# EAGLE schematic CB_1-2 (EAGLE 7.2.0)
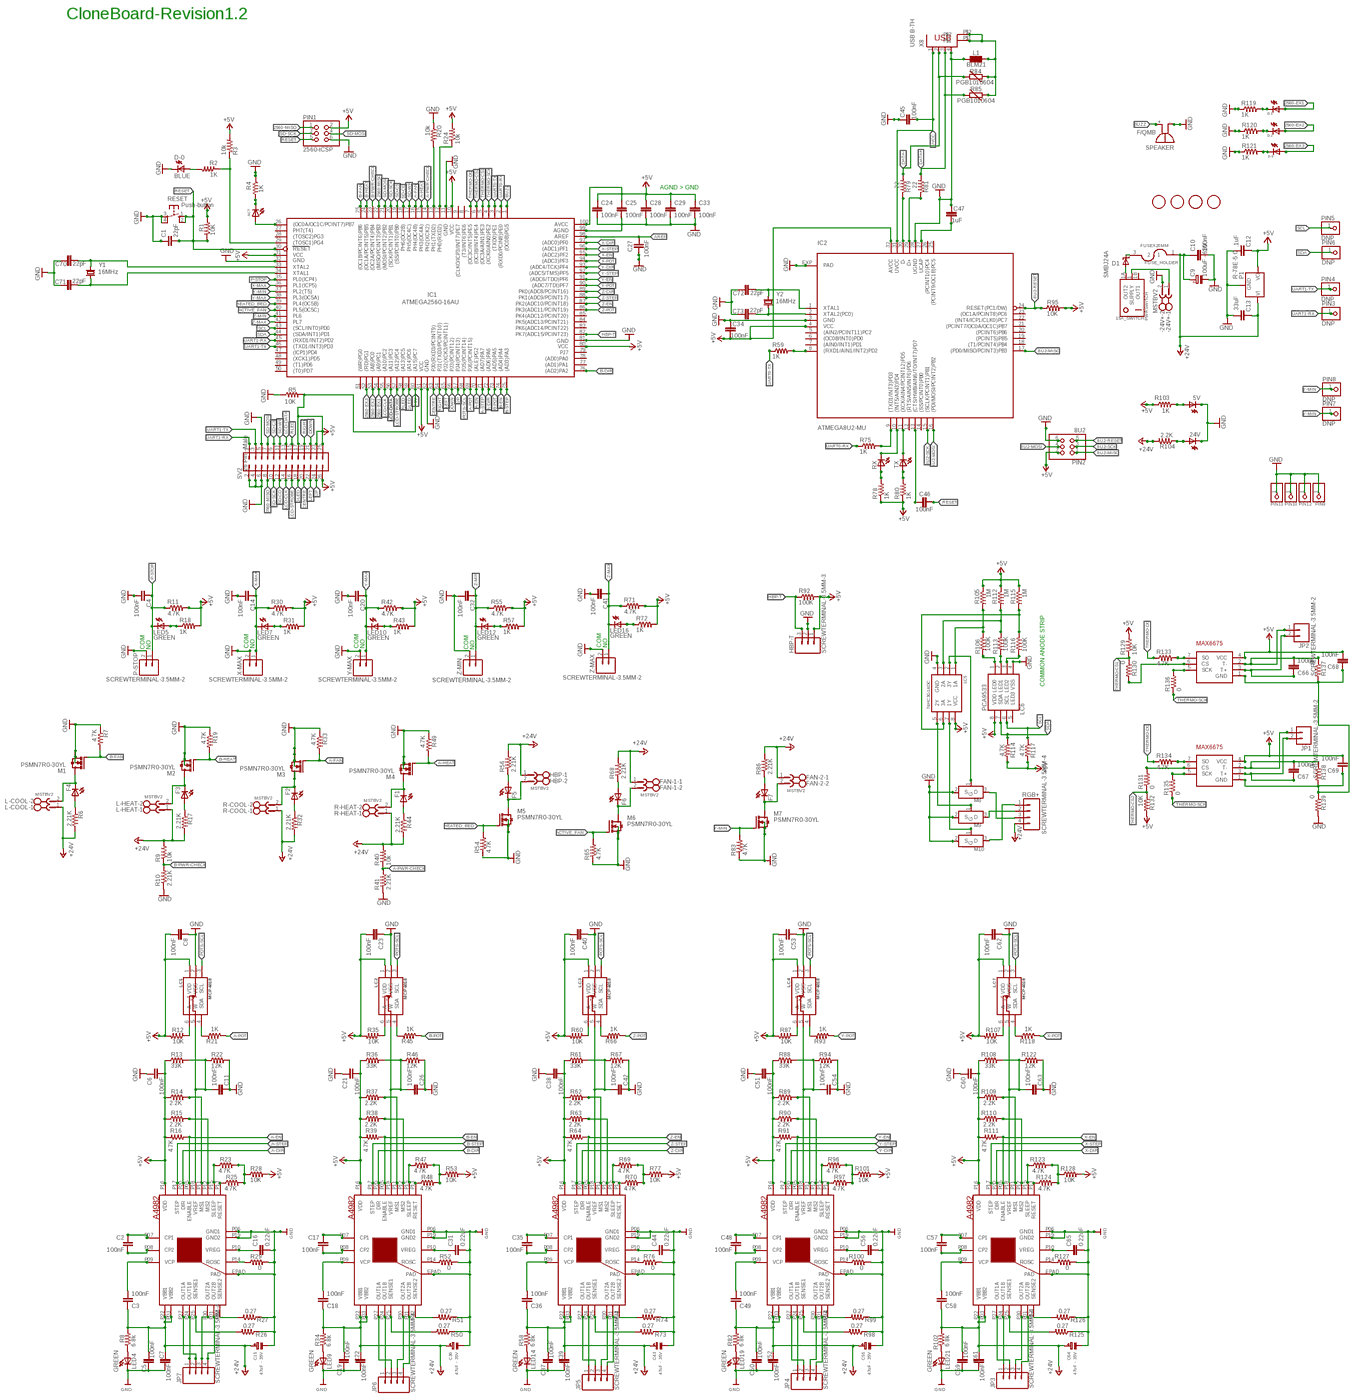
[diagram p0: schematic, sheet 1, overview]
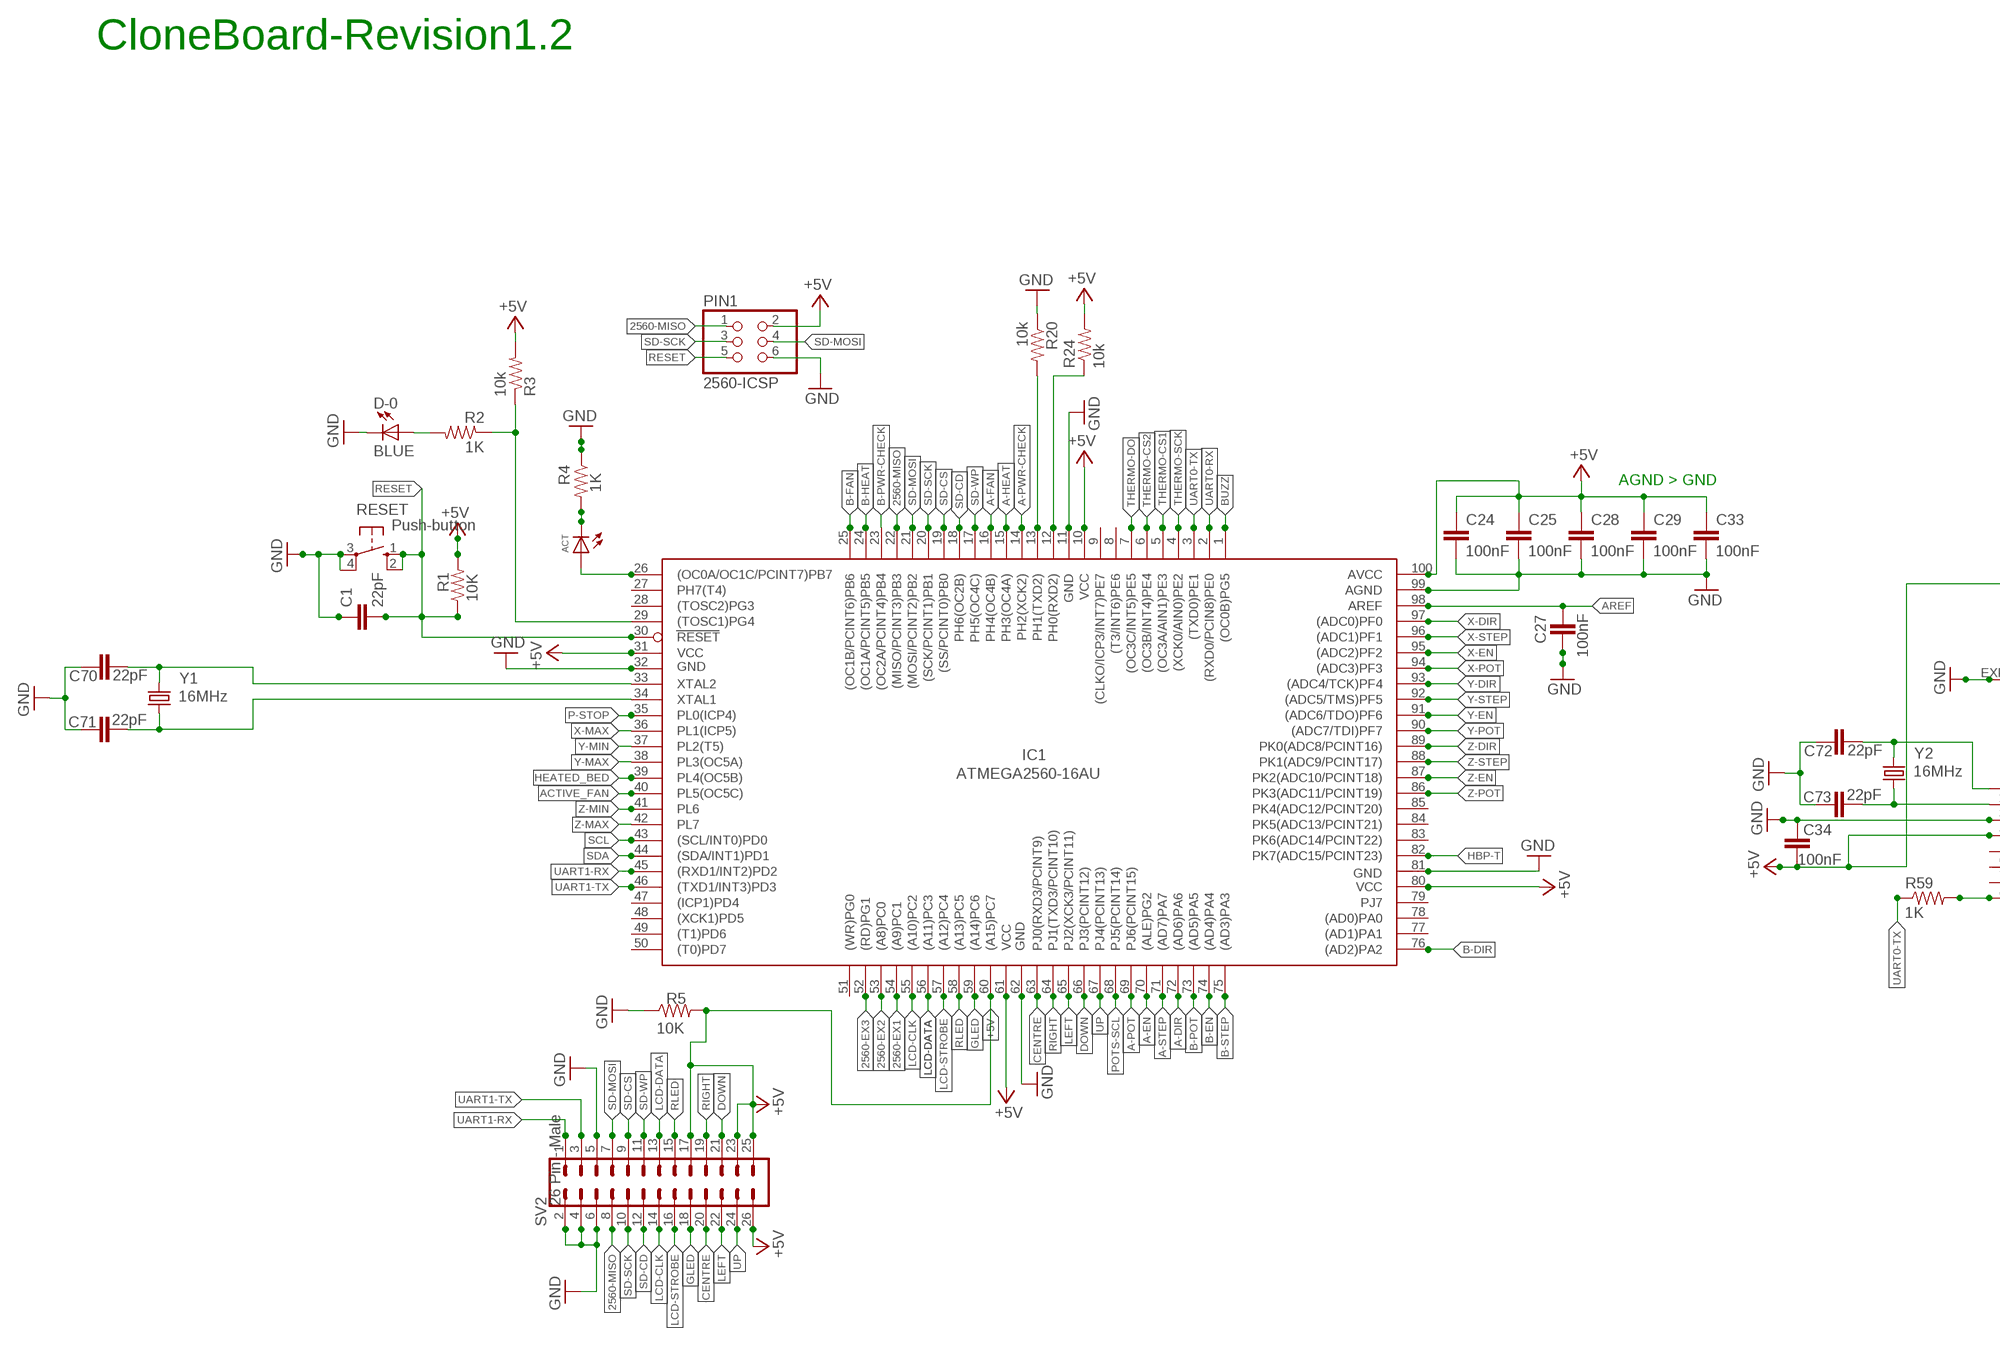
[diagram p1: schematic, sheet 1, part 1 of 4]
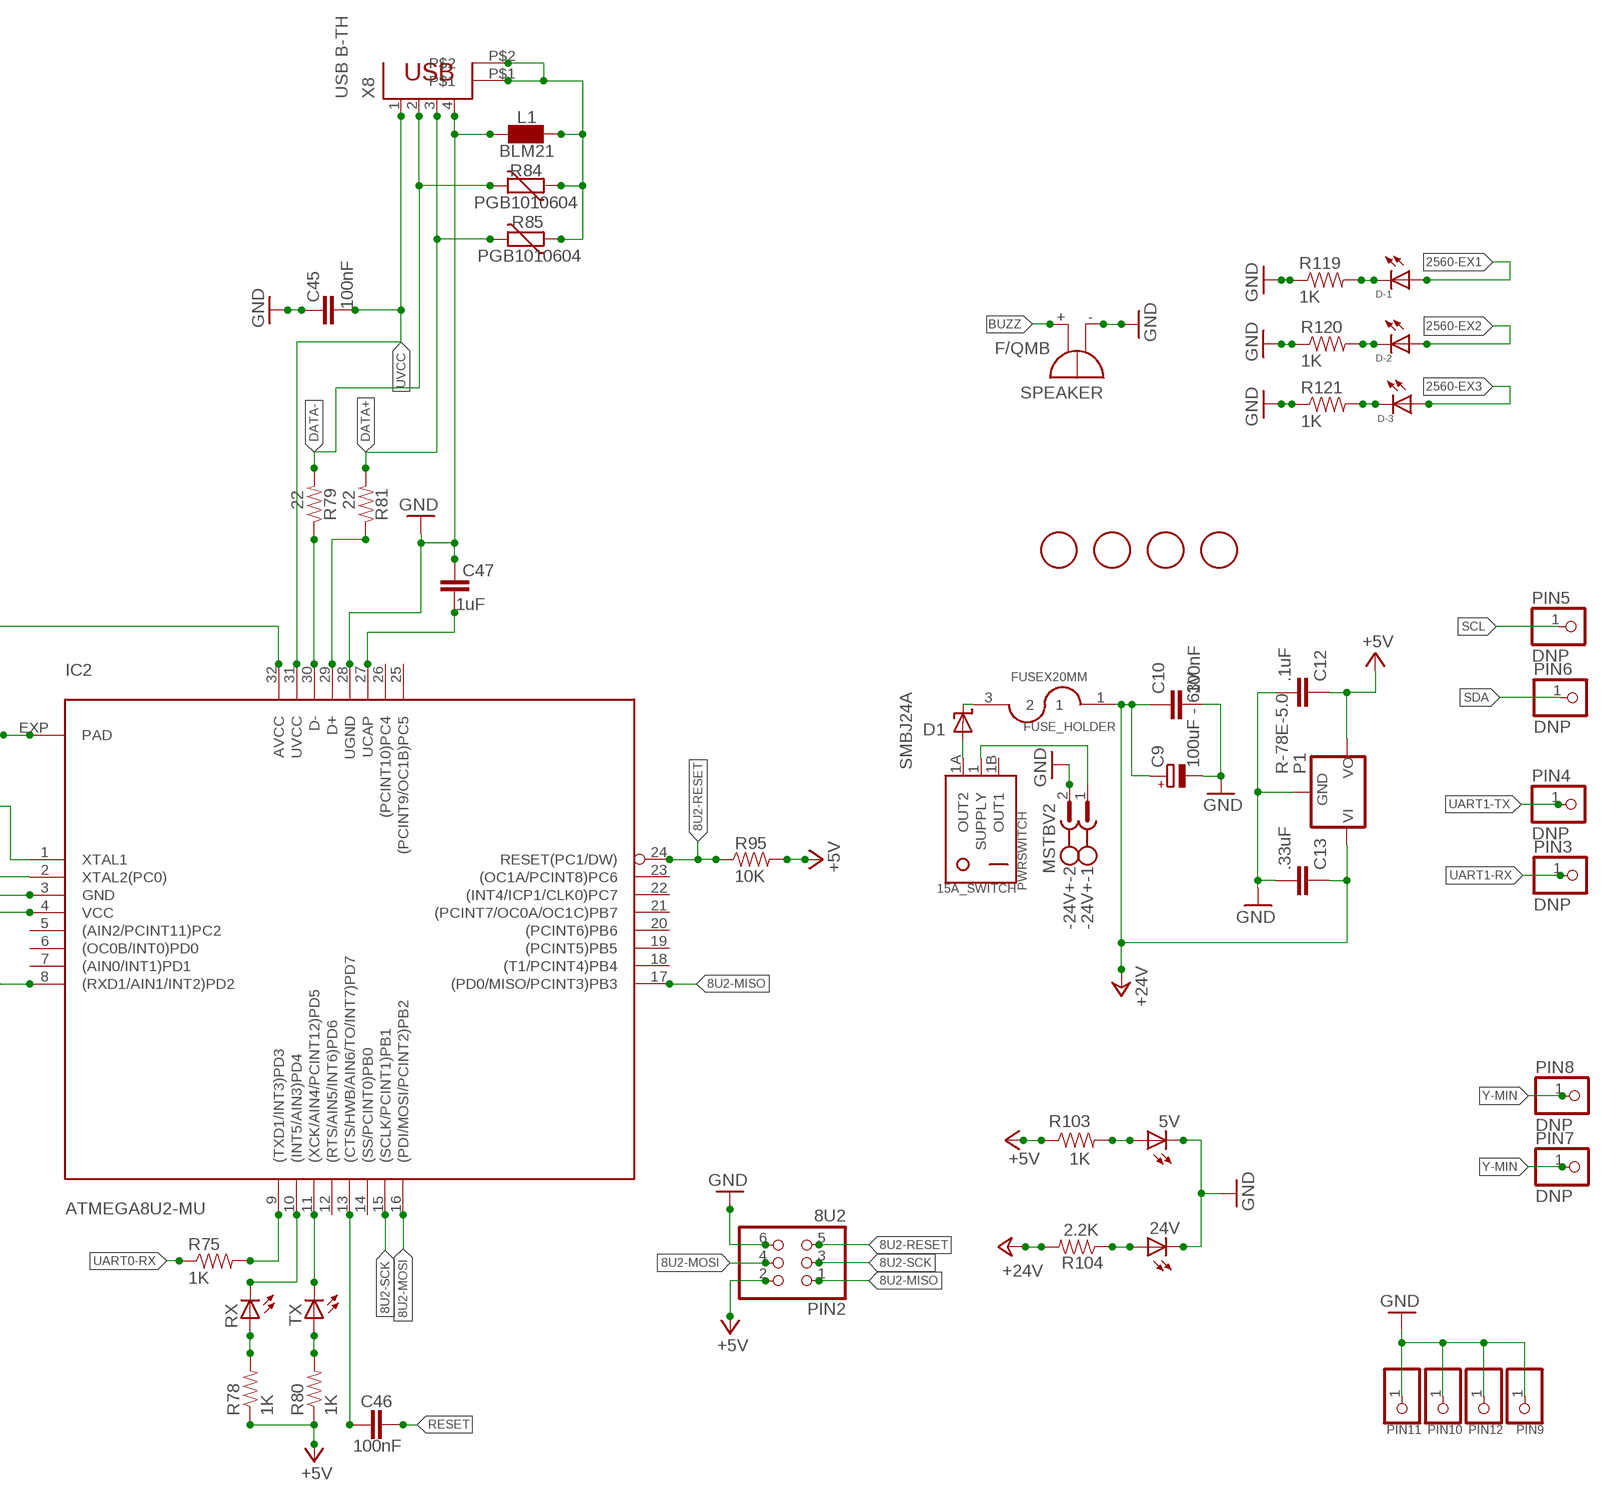
[diagram p2: schematic, sheet 1, part 2 of 4]
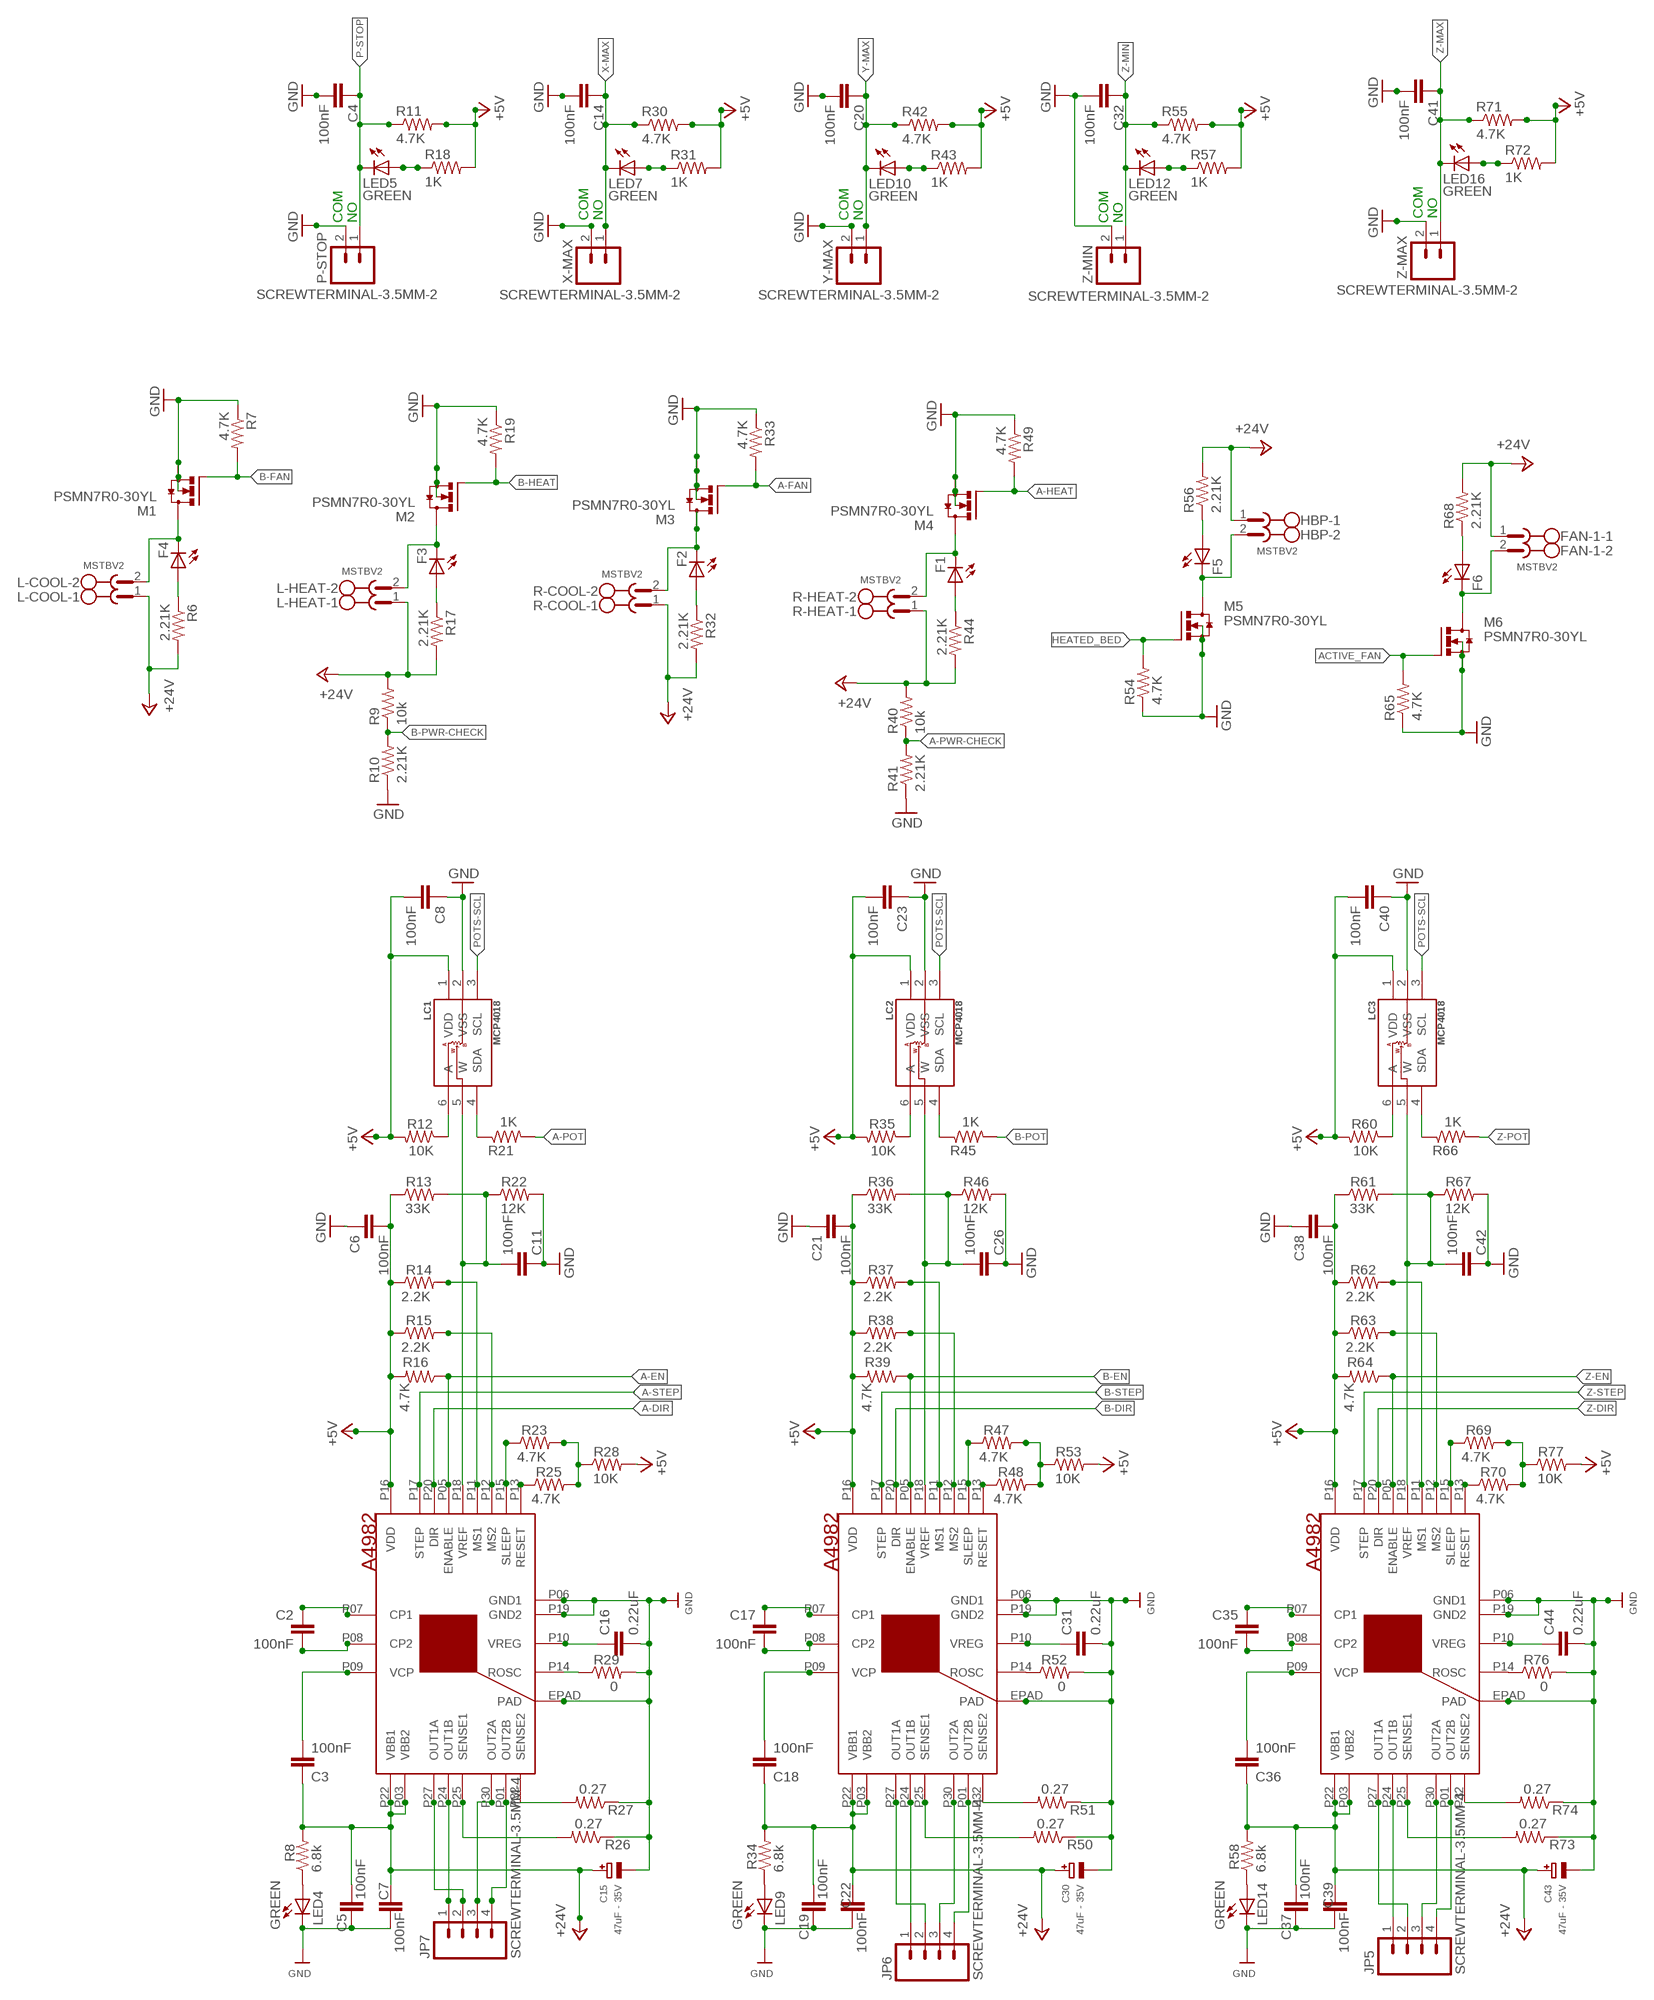
[diagram p3: schematic, sheet 1, part 3 of 4]
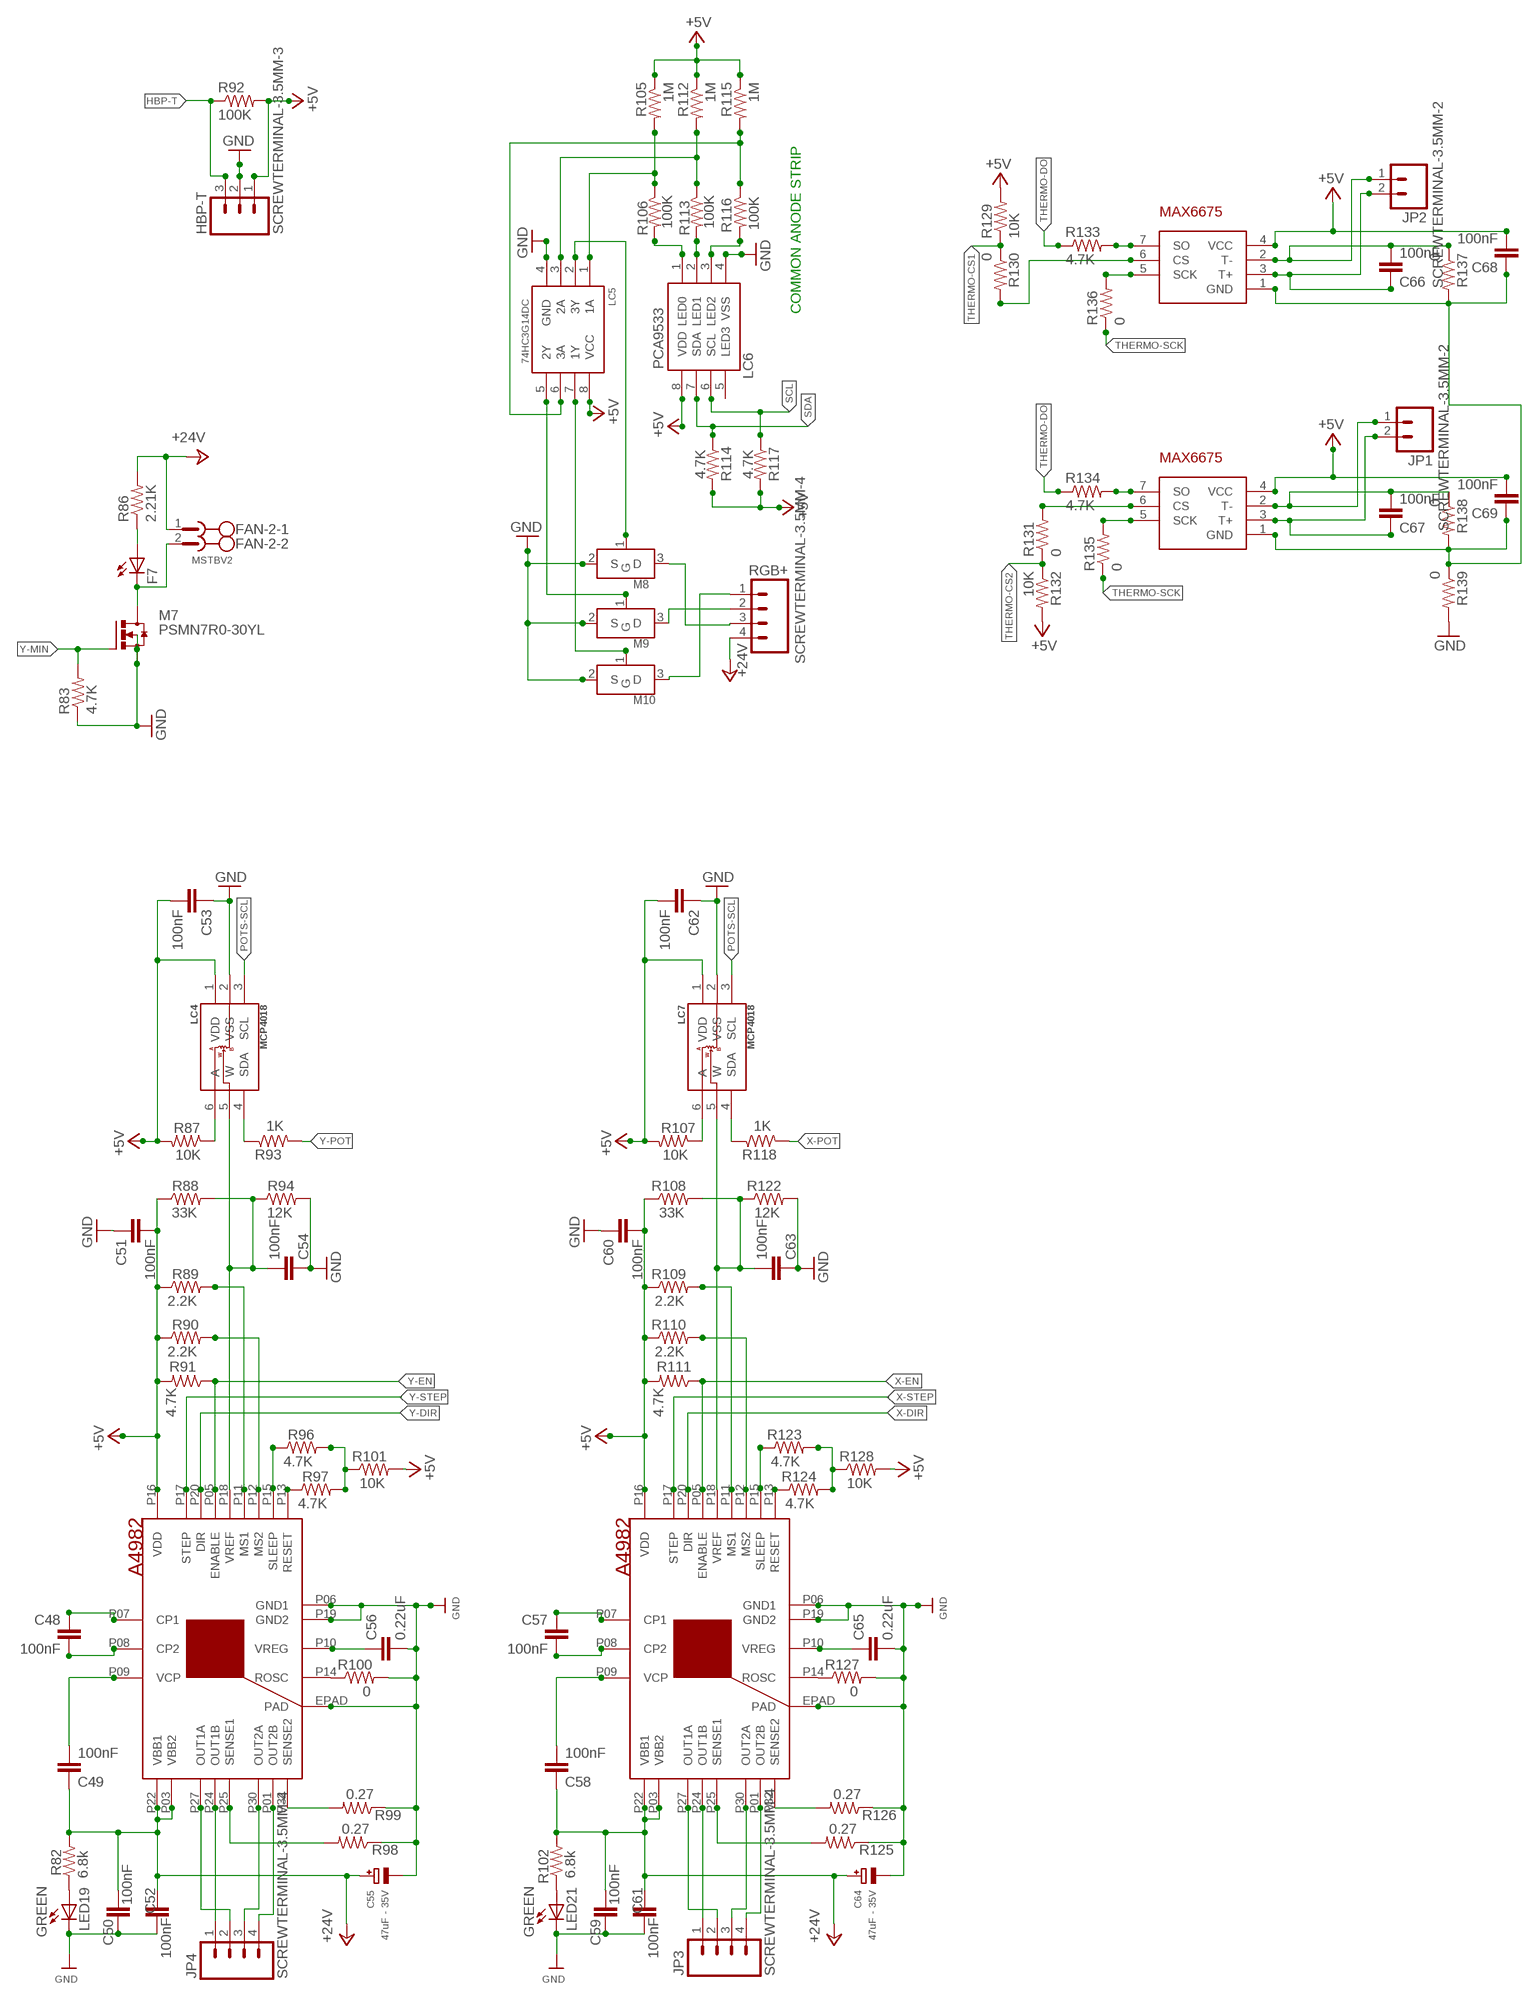
[diagram p4: schematic, sheet 1, part 4 of 4]

## Parts
5V  BLUE  LED0805  [LED-0805]
15A_SWITCH  PWRSWITCH  [D501JT2S2APQF]
24V  GREEN  LED0805  [LED-0805]
-24V+  MSTBV2  [MSTBV2]
A1  A4982ETSSOP32  [ETSSOP32]
A2  A4982ETSSOP32  [ETSSOP32]
A3  A4982ETSSOP32  [ETSSOP32]
A4  A4982ETSSOP32  [ETSSOP32]
A5  A4982ETSSOP32  [ETSSOP32]
ACT  BLUE  LED0805  [LED-0805]
C1  22pF  CAP0805  [0805]
C2  100nF  CAP0805  [0805]
C3  100nF  CAP0805  [0805]
C4  100nF  CAP0805  [0805]
C5  100nF  CAP0805  [0805]
C6  100nF  CAP0805  [0805]
C7  100nF  CAP0805  [0805]
C8  100nF  CAP0805  [0805]
C9  100uF - 63V  CPOL-EUE3.5-8  [E3,5-8]
C10  100nF  CAP0805  [0805]
C11  100nF  CAP0805  [0805]
C12  .1uF  C-EUC0603  [C0603]
C13  .33uF  C-EUC0603  [C0603]
C14  100nF  CAP0805  [0805]
C15  47uF - 35V  CAP_TANTALUMD/7343_REFLOW  [EIA7343-31/D-R]
C16  0.22uF  CAP0805  [0805]
C17  100nF  CAP0805  [0805]
C18  100nF  CAP0805  [0805]
C19  100nF  CAP0805  [0805]
C20  100nF  CAP0805  [0805]
C21  100nF  CAP0805  [0805]
C22  100nF  CAP0805  [0805]
C23  100nF  CAP0805  [0805]
C24  100nF  CAP0805  [0805]
C25  100nF  CAP0805  [0805]
C26  100nF  CAP0805  [0805]
C27  100nF  CAP0805  [0805]
C28  100nF  CAP0805  [0805]
C29  100nF  CAP0805  [0805]
C30  47uF - 35V  CAP_TANTALUMD/7343_REFLOW  [EIA7343-31/D-R]
C31  0.22uF  CAP0805  [0805]
C32  100nF  CAP0805  [0805]
C33  100nF  CAP0805  [0805]
C34  100nF  CAP0805  [0805]
C35  100nF  CAP0805  [0805]
C36  100nF  CAP0805  [0805]
C37  100nF  CAP0805  [0805]
C38  100nF  CAP0805  [0805]
C39  100nF  CAP0805  [0805]
C40  100nF  CAP0805  [0805]
C41  100nF  CAP0805  [0805]
C42  100nF  CAP0805  [0805]
C43  47uF - 35V  CAP_TANTALUMD/7343_REFLOW  [EIA7343-31/D-R]
C44  0.22uF  CAP0805  [0805]
C45  100nF  CAP0805  [0805]
C46  100nF  CAP0805  [0805]
C47  1uF  CAP0805  [0805]
C48  100nF  CAP0805  [0805]
C49  100nF  CAP0805  [0805]
C50  100nF  CAP0805  [0805]
C51  100nF  CAP0805  [0805]
C52  100nF  CAP0805  [0805]
C53  100nF  CAP0805  [0805]
C54  100nF  CAP0805  [0805]
C55  47uF - 35V  CAP_TANTALUMD/7343_REFLOW  [EIA7343-31/D-R]
C56  0.22uF  CAP0805  [0805]
C57  100nF  CAP0805  [0805]
C58  100nF  CAP0805  [0805]
C59  100nF  CAP0805  [0805]
C60  100nF  CAP0805  [0805]
C61  100nF  CAP0805  [0805]
C62  100nF  CAP0805  [0805]
C63  100nF  CAP0805  [0805]
C64  47uF - 35V  CAP_TANTALUMD/7343_REFLOW  [EIA7343-31/D-R]
C65  0.22uF  CAP0805  [0805]
C66  100nF  CAP0805  [0805]
C67  100nF  CAP0805  [0805]
C68  100nF  CAP0805  [0805]
C69  100nF  CAP0805  [0805]
C70  22pF  CAP0805  [0805]
C71  22pF  CAP0805  [0805]
C72  22pF  CAP0805  [0805]
C73  22pF  CAP0805  [0805]
D1  SMBJ24A  SUPPRESSOR-SMBJ  [SMBJ]
D-0  BLUE  LED0805  [LED-0805]
D-1  YELLOW  LED0805  [LED-0805]
D-2  ORANGE  LED0805  [LED-0805]
D-3  RED  LED0805  [LED-0805]
F1  RED  LED0805  [LED-0805]
F2  Yellow  LED0805  [LED-0805]
F3  RED  LED0805  [LED-0805]
F4  Yellow  LED0805  [LED-0805]
F5  RED  LED0805  [LED-0805]
F6  Yellow  LED0805  [LED-0805]
F7  Yellow  LED0805  [LED-0805]
FAN-1  MSTBV2  [MSTBV2]
FAN-2  MSTBV2  [MSTBV2]
FID1  FIDUCIALMOUNT  [FIDUCIA-MOUNT]
FID2  FIDUCIALMOUNT  [FIDUCIA-MOUNT]
FID3  FIDUCIALMOUNT  [FIDUCIA-MOUNT]
FID4  FIDUCIALMOUNT  [FIDUCIA-MOUNT]
FUSE_HOLDER  FUSEX20MM  [FUSE_5MM]
HBP  MSTBV2  [MSTBV2]
HBP-T  SCREWTERMINAL-3.5MM-3  M03SCREW  [SCREWTERMINAL-3.5MM-3]
IC1  ATMEGA2560-16AU  [TQFP100]
IC2  ATMEGA8U2-MU  ATMEGA8U2  [ATMEL_QFN32]
JP1  SCREWTERMINAL-3.5MM-2  M023.5MM  [SCREWTERMINAL-3.5MM-2]
JP2  SCREWTERMINAL-3.5MM-2  M023.5MM  [SCREWTERMINAL-3.5MM-2]
JP3  SCREWTERMINAL-3.5MM-4  M04SCREW_LOCK  [SCREWTERMINAL-3.5MM-4_LOCK]
JP4  SCREWTERMINAL-3.5MM-4  M04SCREW_LOCK  [SCREWTERMINAL-3.5MM-4_LOCK]
JP5  SCREWTERMINAL-3.5MM-4  M04SCREW_LOCK  [SCREWTERMINAL-3.5MM-4_LOCK]
JP6  SCREWTERMINAL-3.5MM-4  M04SCREW_LOCK  [SCREWTERMINAL-3.5MM-4_LOCK]
JP7  SCREWTERMINAL-3.5MM-4  M04SCREW_LOCK  [SCREWTERMINAL-3.5MM-4_LOCK]
L1  BLM21  WE-CBF_0805  [0805]
L-COOL  MSTBV2  [MSTBV2]
L-HEAT  MSTBV2  [MSTBV2]
LC1  MCP4018  [SC70-6L]
LC2  MCP4018  [SC70-6L]
LC3  MCP4018  [SC70-6L]
LC4  MCP4018  [SC70-6L]
LC5  74HC3G14DC  [VSSOP8]
LC6  PCA9533  [SO8]
LC7  MCP4018  [SC70-6L]
LED4  GREEN  LED0805  [LED-0805]
LED5  GREEN  LED0805  [LED-0805]
LED7  GREEN  LED0805  [LED-0805]
LED9  GREEN  LED0805  [LED-0805]
LED10  GREEN  LED0805  [LED-0805]
LED12  GREEN  LED0805  [LED-0805]
LED14  GREEN  LED0805  [LED-0805]
LED16  GREEN  LED0805  [LED-0805]
LED19  GREEN  LED0805  [LED-0805]
LED21  GREEN  LED0805  [LED-0805]
M1  PSMN7R0-30YL  [SOT669]
M2  PSMN7R0-30YL  [SOT669]
M3  PSMN7R0-30YL  [SOT669]
M4  PSMN7R0-30YL  [SOT669]
M5  PSMN7R0-30YL  [SOT669]
M6  PSMN7R0-30YL  [SOT669]
M7  PSMN7R0-30YL  [SOT669]
M8  FDV301N  [SOT-23]
M9  FDV301N  [SOT-23]
M10  FDV301N  [SOT-23]
P1  R-78E-5.0  R-78  [R-78]
P-STOP  SCREWTERMINAL-3.5MM-2  M023.5MM  [SCREWTERMINAL-3.5MM-2]
PIN1  2560-ICSP  PINHD-2X3  [2X03]
PIN2  8U2  PINHD-2X3  [2X03]
PIN3  DNP  PINHD-1X1  [1X01]
PIN4  DNP  PINHD-1X1  [1X01]
PIN5  DNP  PINHD-1X1  [1X01]
PIN6  DNP  PINHD-1X1  [1X01]
PIN7  DNP  PINHD-1X1  [1X01]
PIN8  DNP  PINHD-1X1  [1X01]
PIN9  DNP  PINHD-1X1  [1X01]
PIN10  DNP  PINHD-1X1  [1X01]
PIN11  DNP  PINHD-1X1  [1X01]
PIN12  DNP  PINHD-1X1  [1X01]
R1  10K  RESISTOR  [0805]
R2  1K  RESISTOR  [0805]
R3  10k  RESISTOR  [0805]
R4  1K  RESISTOR  [0805]
R5  10K  RESISTOR  [0805]
R6  2.21K  RESISTOR  [0805]
R7  4.7K  RESISTOR  [0805]
R8  6.8k  RESISTOR  [0805]
R9  10k  RESISTOR  [0805]
R10  2.21K  RESISTOR  [0805]
R11  4.7K  RESISTOR  [0805]
R12  10K  RESISTOR  [0805]
R13  33K  RESISTOR  [0805]
R14  2.2K  RESISTOR  [0805]
R15  2.2K  RESISTOR  [0805]
R16  4.7K  RESISTOR  [0805]
R17  2.21K  RESISTOR  [0805]
R18  1K  RESISTOR  [0805]
R19  4.7K  RESISTOR  [0805]
R20  10k  RESISTOR  [0805]
R21  1K  RESISTOR  [0805]
R22  12K  RESISTOR  [0805]
R23  4.7K  RESISTOR  [0805]
R24  10k  RESISTOR  [0805]
R25  4.7K  RESISTOR  [0805]
R26  0.27  RESISTOR  [0805]
R27  0.27  RESISTOR  [0805]
R28  10K  RESISTOR  [0805]
R29  0  RESISTOR  [0805]
R30  4.7K  RESISTOR  [0805]
R31  1K  RESISTOR  [0805]
R32  2.21K  RESISTOR  [0805]
R33  4.7K  RESISTOR  [0805]
R34  6.8k  RESISTOR  [0805]
R35  10K  RESISTOR  [0805]
R36  33K  RESISTOR  [0805]
R37  2.2K  RESISTOR  [0805]
R38  2.2K  RESISTOR  [0805]
R39  4.7K  RESISTOR  [0805]
R40  10k  RESISTOR  [0805]
R41  2.21K  RESISTOR  [0805]
R42  4.7K  RESISTOR  [0805]
R43  1K  RESISTOR  [0805]
R44  2.21K  RESISTOR  [0805]
R45  1K  RESISTOR  [0805]
R46  12K  RESISTOR  [0805]
R47  4.7K  RESISTOR  [0805]
R48  4.7K  RESISTOR  [0805]
R49  4.7K  RESISTOR  [0805]
R50  0.27  RESISTOR  [0805]
R51  0.27  RESISTOR  [0805]
R52  0  RESISTOR  [0805]
R53  10K  RESISTOR  [0805]
R54  4.7K  RESISTOR  [0805]
R55  4.7K  RESISTOR  [0805]
R56  2.21K  RESISTOR  [0805]
R57  1K  RESISTOR  [0805]
R58  6.8k  RESISTOR  [0805]
R59  1K  RESISTOR  [0805]
R60  10K  RESISTOR  [0805]
R61  33K  RESISTOR  [0805]
R62  2.2K  RESISTOR  [0805]
R63  2.2K  RESISTOR  [0805]
R64  4.7K  RESISTOR  [0805]
R65  4.7K  RESISTOR  [0805]
R66  1K  RESISTOR  [0805]
R67  12K  RESISTOR  [0805]
R68  2.21K  RESISTOR  [0805]
R69  4.7K  RESISTOR  [0805]
R70  4.7K  RESISTOR  [0805]
R71  4.7K  RESISTOR  [0805]
R72  1K  RESISTOR  [0805]
R73  0.27  RESISTOR  [0805]
R74  0.27  RESISTOR  [0805]
R75  1K  RESISTOR  [0805]
R76  0  RESISTOR  [0805]
R77  10K  RESISTOR  [0805]
R78  1K  RESISTOR  [0805]
R79  22  RESISTOR  [0805]
R80  1K  RESISTOR  [0805]
R81  22  RESISTOR  [0805]
R82  6.8k  RESISTOR  [0805]
R83  4.7K  RESISTOR  [0805]
R84  PGB1010604  VARISTORCN0603  [CT/CN0603]
R85  PGB1010604  VARISTORCN0603  [CT/CN0603]
R86  2.21K  RESISTOR  [0805]
R87  10K  RESISTOR  [0805]
R88  33K  RESISTOR  [0805]
R89  2.2K  RESISTOR  [0805]
R90  2.2K  RESISTOR  [0805]
R91  4.7K  RESISTOR  [0805]
R92  100K  RESISTOR  [0805]
R93  1K  RESISTOR  [0805]
R94  12K  RESISTOR  [0805]
R95  10K  RESISTOR  [0805]
R96  4.7K  RESISTOR  [0805]
R97  4.7K  RESISTOR  [0805]
R98  0.27  RESISTOR  [0805]
R99  0.27  RESISTOR  [0805]
R100  0  RESISTOR  [0805]
R101  10K  RESISTOR  [0805]
R102  6.8k  RESISTOR  [0805]
R103  1K  RESISTOR  [0805]
R104  2.2K  RESISTOR  [0805]
R105  1M  RESISTOR  [0805]
R106  100K  RESISTOR  [0805]
R107  10K  RESISTOR  [0805]
R108  33K  RESISTOR  [0805]
R109  2.2K  RESISTOR  [0805]
R110  2.2K  RESISTOR  [0805]
R111  4.7K  RESISTOR  [0805]
R112  1M  RESISTOR  [0805]
R113  100K  RESISTOR  [0805]
R114  4.7K  RESISTOR  [0805]
R115  1M  RESISTOR  [0805]
R116  100K  RESISTOR  [0805]
R117  4.7K  RESISTOR  [0805]
R118  1K  RESISTOR  [0805]
R119  1K  RESISTOR  [0805]
R120  1K  RESISTOR  [0805]
R121  1K  RESISTOR  [0805]
R122  12K  RESISTOR  [0805]
R123  4.7K  RESISTOR  [0805]
R124  4.7K  RESISTOR  [0805]
R125  0.27  RESISTOR  [0805]
R126  0.27  RESISTOR  [0805]
R127  0  RESISTOR  [0805]
R128  10K  RESISTOR  [0805]
R129  10K  RESISTOR  [0805]
R130  0  RESISTOR  [0805]
R131  0  RESISTOR  [0805]
R132  10K  RESISTOR  [0805]
R133  4.7K  RESISTOR  [0805]
R134  4.7K  RESISTOR  [0805]
R135  0  RESISTOR  [0805]
R136  0  RESISTOR  [0805]
R137  0  RESISTOR  [0805]
R138  0  RESISTOR  [0805]
R139  0  RESISTOR  [0805]
R-COOL  MSTBV2  [MSTBV2]
R-HEAT  MSTBV2  [MSTBV2]
RESET  Push-button  10-XX  [B3F-10XX]
RGB+  SCREWTERMINAL-3.5MM-4  M04SCREW  [SCREWTERMINAL-3.5MM-4]
RX  YELLOW  LED0805  [LED-0805]
SPEAKER  F/QMB  [F/QMB]
SV2  26 Pin - Male  ML26  [ML26]
T1  MAX6675  [SO08]
T2  MAX6675  [SO08]
TX  YELLOW  LED0805  [LED-0805]
X8  USB B-TH  PN61729  [PN61729]
X-MAX  SCREWTERMINAL-3.5MM-2  M023.5MM  [SCREWTERMINAL-3.5MM-2]
Y1  16MHz  CRYTALHC49S  [HC49/S]
Y2  16MHz  CRYTALHC49S  [HC49/S]
Y-MAX  SCREWTERMINAL-3.5MM-2  M023.5MM  [SCREWTERMINAL-3.5MM-2]
Z-MAX  SCREWTERMINAL-3.5MM-2  M023.5MM  [SCREWTERMINAL-3.5MM-2]
Z-MIN  SCREWTERMINAL-3.5MM-2  M023.5MM  [SCREWTERMINAL-3.5MM-2]

## Nets
8U2-MISO: IC2.17((PD0/MISO/PCINT3)PB3) PIN2.1
8U2-MOSI: IC2.16((PDI/MOSI/PCINT2)PB2) PIN2.4
8U2-RESET: IC2.24(RESET(PC1/DW)) PIN2.5 R95.1
8U2-SCK: IC2.15((SCLK/PCINT1)PB1) PIN2.3
2560-EX1: D-1.A IC1.54((A9)PC1)
2560-EX2: D-2.A IC1.53((A8)PC0)
2560-EX3: D-3.A IC1.52((RD)PG1)
2560-MISO: IC1.22((MISO/PCINT3)PB3) PIN1.1 SV2.8
+5V: A1.P16(VDD) A2.P16(VDD) A3.P16(VDD) A4.P16(VDD) A5.P16(VDD) C6.2 C8.2 C12.1 C21.2 C23.2 C24.1 C25.1 C28.1 C29.1 C33.1 C34.2 C38.2 C40.2 C51.2 C53.2 C60.2 C62.2 C68.2 C69.2 HBP-T.1 IC1.10(VCC) IC1.31(VCC1) IC1.60((A15)PC7) IC1.61(VCC2) IC1.80(VCC3) IC1.100(AVCC) IC2.4(VCC) IC2.32(AVCC) LC1.1(VDD) LC2.1(VDD) LC3.1(VDD) LC4.1(VDD) LC5.8(VCC) LC6.8(VDD) LC7.1(VDD) P1.3(VO) PIN1.2 PIN2.2 R1.2 R3.2 R5.2 R11.2 R12.2 R13.1 R14.1 R15.1 R16.2 R18.2 R24.2 R28.2 R30.2 R31.2 R35.2 R36.1 R37.1 R38.1 R39.2 R42.2 R43.2 R53.2 R55.2 R57.2 R60.2 R61.1 R62.1 R63.1 R64.2 R71.2 R72.2 R77.2 R78.1 R80.1 R87.2 R88.1 R89.1 R90.1 R91.2 R92.2 R95.2 R101.2 R103.1 R105.1 R107.2 R108.1 R109.1 R110.1 R111.2 R112.1 R114.2 R115.1 R117.2 R128.2 R129.2 R132.2 SV2.17 SV2.23 SV2.25 SV2.26 T1.4(VCC) T2.4(VCC)
+24V [24V]: A1.P03(VBB2) A1.P22(VBB1) A2.P03(VBB2) A2.P22(VBB1) A3.P03(VBB2) A3.P22(VBB1) A4.P03(VBB2) A4.P22(VBB1) A5.P03(VBB2) A5.P22(VBB1) C3.1 C5.2 C7.2 C9.+ C10.1 C13.1 C15.+ C18.1 C19.2 C22.2 C30.+ C36.1 C37.2 C39.2 C43.+ C49.1 C50.2 C52.2 C55.+ C58.1 C59.2 C61.2 C64.+ FAN-1.1 FAN-2.1 FUSE_HOLDER.1 HBP.1 L-COOL.1 L-HEAT.1 P1.1(VI) R6.2 R8.2 R9.2 R17.2 R32.2 R34.2 R40.2 R44.2 R56.2 R58.2 R68.2 R82.2 R86.2 R102.2 R104.2 R-COOL.1 R-HEAT.1 RGB+.4
A-DIR: A1.P20(DIR) IC1.72((AD6)PA6)
A-EN: A1.P05(ENABLE) IC1.70((ALE)PG2) R16.1
A-FAN: IC1.16(PH4(OC4B)) M3.4(G) R33.2
A-HEAT: IC1.15(PH3(OC4A)) M4.4(G) R49.2
A-POT: IC1.69(PJ6(PCINT15)) R21.2
A-PWR-CHECK: IC1.14(PH2(XCK2)) R40.1 R41.2
A-STEP: A1.P17(STEP) IC1.71((AD7)PA7)
ACTIVE_FAN: IC1.40(PL5(OC5C)) M6.4(G) R65.2
AREF: C27.1 IC1.98(AREF)
B-DIR: A2.P20(DIR) IC1.76((AD2)PA2)
B-EN: A2.P05(ENABLE) IC1.74((AD4)PA4) R39.1
B-FAN: IC1.25((OC1B/PCINT6)PB6) M1.4(G) R7.2
B-HEAT: IC1.24((OC1A/PCINT5)PB5) M2.4(G) R19.2
B-POT: IC1.73((AD5)PA5) R45.2
B-PWR-CHECK: IC1.23((OC2A/PCINT4)PB4) R9.1 R10.2
B-STEP: A2.P17(STEP) IC1.75((AD3)PA3)
BUZZ: IC1.1((OC0B)PG5) SPEAKER.+(-)
CENTRE: IC1.63(PJ0(RXD3/PCINT9)) SV2.20
CUTOFF-SR-CHECK: IC1.29((TOSC1)PG4) R2.1 R3.1
DATA+: R81.2 R85.2 X8.3
DATA-: R79.2 R84.2 X8.2
DOWN: IC1.66(PJ3(PCINT12)) SV2.21
DTR2: C46.1 IC2.13((CTS/HWB/AIN6/TO/INT7)PD7)
GLED: IC1.59((A14)PC6) SV2.18
GND: 5V.C 24V.C -24V+.2 A1.EPAD(PAD) A1.P06(GND1) A1.P19(GND2) A2.EPAD(PAD) A2.P06(GND1) A2.P19(GND2) A3.EPAD(PAD) A3.P06(GND1) A3.P19(GND2) A4.EPAD(PAD) A4.P06(GND1) A4.P19(GND2) A5.EPAD(PAD) A5.P06(GND1) A5.P19(GND2) C1.1 C4.2 C5.1 C6.1 C7.1 C8.1 C9.- C10.2 C11.1 C12.2 C13.2 C14.2 C15.- C16.2 C19.1 C20.2 C21.1 C22.1 C23.1 C24.2 C25.2 C26.1 C27.2 C28.2 C29.2 C30.- C31.2 C32.2 C33.2 C34.1 C37.1 C38.1 C39.1 C40.1 C41.2 C42.1 C43.- C44.2 C45.1 C47.1 C50.1 C51.1 C52.1 C53.1 C54.1 C55.- C56.2 C59.1 C60.1 C61.1 C62.1 C63.1 C64.- C65.2 C70.1 C71.1 C72.1 C73.1 D-0.C HBP-T.2 IC1.11(GND) IC1.32(GND1) IC1.62(GND2) IC1.81(GND3) IC1.99(AGND) IC2.3(GND) IC2.28(UGND) IC2.EXP(PAD) L1.1 LC1.2(VSS) LC2.2(VSS) LC3.2(VSS) LC4.2(VSS) LC5.4(GND) LC6.4(VSS) LC7.2(VSS) LED4.C LED9.C LED14.C LED19.C LED21.C M1.1(S) M1.2(S) M1.3(S) M2.1(S) M2.2(S) M2.3(S) M3.1(S) M3.2(S) M3.3(S) M4.1(S) M4.2(S) M4.3(S) M5.1(S) M5.2(S) M5.3(S) M6.1(S) M6.2(S) M6.3(S) M7.1(S) M7.2(S) M7.3(S) M8.2(S) M9.2(S) M10.2(S) P1.2(GND) P-STOP.2 PIN1.6 PIN2.6 PIN9.1 PIN10.1 PIN11.1 PIN12.1 R4.1 R5.1 R7.1 R10.1 R19.1 R20.1 R22.2 R26.1 R27.1 R29.2 R33.1 R41.1 R46.2 R49.1 R50.1 R51.1 R52.2 R54.1 R65.1 R67.2 R73.1 R74.1 R76.2 R83.1 R94.2 R98.1 R99.1 R100.2 R119.1 R120.1 R121.1 R122.2 R125.1 R126.1 R127.2 R139.2 RESET.3(P) RESET.4(P1) SPEAKER.-(+) SV2.2 SV2.4 SV2.5 SV2.6 X8.4 X-MAX.2 Y-MAX.2 Z-MAX.2 Z-MIN.2
HBP-T: HBP-T.3 IC1.82(PK7(ADC15/PCINT23)) R92.1
HEATED_BED: IC1.39(PL4(OC5B)) M5.4(G) R54.2
LCD-CLK: IC1.55((A10)PC2) SV2.14
LCD-DATA: IC1.56((A11)PC3) SV2.13
LCD-STROBE: IC1.57((A12)PC4) SV2.16
LEFT: IC1.65(PJ2(XCK3/PCINT11)) SV2.22
MS6: A1.P12(MS2) R15.2
MS7: A2.P12(MS2) R38.2
MS8: A3.P12(MS2) R63.2
MS9: A4.P12(MS2) R90.2
MS10: A5.P12(MS2) R110.2
N$1: A1.P09(VCP) C3.2
N$2: LED4.A R8.1
N$3: A1.P10(VREG) C16.1
N$4: LC1.6(A) R12.1
N$5: LC1.4(SDA) R21.1
N$6: R23.2 R25.2 R28.1
N$7: 5V.A R103.2
N$8: A1.P15(SLEEP) R23.1
N$9: LED16.A R72.1
N$10: 24V.A R104.1
N$12: LC6.1(LED0) R106.2
N$14: LC6.3(LED2) R116.2
N$15: LC6.2(LED1) R113.2
N$16: M10.3(D) RGB+.1
N$17: M9.3(D) RGB+.2
N$18: LED10.A R43.1
N$19 [24V]: F3.A R17.1
N$20: LED7.A R31.1
N$21: LED5.A R18.1
N$22: 15A_SWITCH.1(SUPPLY) -24V+.1
N$23: 15A_SWITCH.1A(OUT2) D1.A
N$26: A1.P13(RESET) R25.1
N$27: LC5.6(3A) R115.2 R116.1
N$28: LC5.1(1A) R105.2 R106.1
N$29: A1.P11(MS1) R14.2
N$30: C66.1 JP2.2 T1.3(T+)
N$32: M8.3(D) RGB+.3
N$33: A1.P18(VREF) C11.2 LC1.5(W) R13.2 R22.1
N$34: LC5.3(2A) R112.2 R113.1
N$35: A1.P07(CP1) C2.1
N$36: LC5.2(3Y) M8.1(G)
N$37 [24V]: F3.C L-HEAT.2 M2.MB(D)
N$38: C67.1 JP1.2 T2.3(T+)
N$39: R130.2 T1.6(CS)
N$40: R136.2 T1.5(SCK)
N$41: LC5.5(2Y) M9.1(G)
N$42: R131.2 T2.6(CS)
N$43: C68.1 C69.1 R137.2 R138.2 R139.1 T1.1(GND) T2.1(GND)
N$44: R135.2 T2.5(SCK)
N$45: C66.2 JP2.1 R137.1 T1.2(T-)
N$46 [24V]: F7.A R86.1
N$47 [24V]: F7.C FAN-2.2 M7.MB(D)
N$56: LC5.7(1Y) M10.1(G)
N$96: C67.2 JP1.1 R138.1 T2.2(T-)
N$98: C71.2 IC1.34(XTAL1) Y1.1
N$100: C70.2 IC1.33(XTAL2) Y1.2
N$138: R133.2 T1.7(SO)
N$139: R134.2 T2.7(SO)
N$140: A1.P08(CP2) C2.2
N$141: A1.P14(ROSC) R29.1
N$142: A2.P09(VCP) C18.2
N$143: LED9.A R34.1
N$144: A2.P10(VREG) C31.1
N$145: LC2.6(A) R35.1
N$146: LC2.4(SDA) R45.1
N$147: R47.2 R48.2 R53.1
N$148: A2.P15(SLEEP) R47.1
N$149: A2.P13(RESET) R48.1
N$150: A2.P11(MS1) R37.2
N$151: A2.P18(VREF) C26.2 LC2.5(W) R36.2 R46.1
N$152: A2.P07(CP1) C17.1
N$153: A2.P08(CP2) C17.2
N$154: A2.P14(ROSC) R52.1
N$155: A3.P09(VCP) C36.2
N$156: LED14.A R58.1
N$157: A3.P10(VREG) C44.1
N$158: LC3.6(A) R60.1
N$159: LC3.4(SDA) R66.1
N$160: R69.2 R70.2 R77.1
N$167: A3.P15(SLEEP) R69.1
N$168: A3.P13(RESET) R70.1
N$169: A3.P11(MS1) R62.2
N$170: A3.P18(VREF) C42.2 LC3.5(W) R61.2 R67.1
N$171: A3.P07(CP1) C35.1
N$174: A3.P08(CP2) C35.2
N$175: A3.P14(ROSC) R76.1
N$178: A4.P09(VCP) C49.2
N$180: LED19.A R82.1
N$181: A4.P10(VREG) C56.1
N$184: LC4.6(A) R87.1
N$186: LC4.4(SDA) R93.1
N$187: R96.2 R97.2 R101.1
N$190: A4.P15(SLEEP) R96.1
N$191: A4.P13(RESET) R97.1
N$197: A4.P11(MS1) R89.2
N$201: A4.P18(VREF) C54.2 LC4.5(W) R88.2 R94.1
N$202: A4.P07(CP1) C48.1
N$203: A4.P08(CP2) C48.2
N$204: D-1.C R119.2
N$205: D-2.C R120.2
N$206: A4.P14(ROSC) R100.1
N$208: A5.P09(VCP) C58.2
N$209: LED21.A R102.1
N$210: A5.P10(VREG) C65.1
N$211: LC7.6(A) R107.1
N$212: LC7.4(SDA) R118.1
N$213: R123.2 R124.2 R128.1
N$214: A5.P15(SLEEP) R123.1
N$215: A5.P13(RESET) R124.1
N$216: A5.P11(MS1) R109.2
N$217: A5.P18(VREF) C63.2 LC7.5(W) R108.2 R122.1
N$218: A5.P07(CP1) C57.1
N$219: D-3.C R121.2
N$220: ACT.C R4.2
N$221: ACT.A IC1.26((OC0A/OC1C/PCINT7)PB7)
N$222: A5.P08(CP2) C57.2
N$223: LED12.A R57.1
N$224: A5.P14(ROSC) R127.1
N$230: C73.2 IC2.2(XTAL2(PC0)) Y2.1
N$231: C72.2 IC2.1(XTAL1) Y2.2
N$370 [24V]: F4.A R6.1
N$404 [24V]: F4.C L-COOL.2 M1.MB(D)
N$405 [24V]: F1.A R44.1
N$1044: D1.C FUSE_HOLDER.3
N$1045: IC1.12(PH0(RXD2)) R24.1
N$1046: D-0.A R2.2
N$1047: IC1.13(PH1(TXD2)) R20.2
N$1048 [24V]: F1.C M4.MB(D) R-HEAT.2
N$1051 [24V]: F2.A R32.1
N$1058 [24V]: F2.C M3.MB(D) R-COOL.2
N$1059 [24V]: F5.A R56.1
N$1060 [24V]: F5.C HBP.2 M5.MB(D)
N$1061 [24V]: F6.A R68.1
N$1063 [24V]: F6.C FAN-1.2 M6.MB(D)
N$1235: R78.2 RX.A
N$1236: R80.2 TX.A
N$1237: IC2.10((INT5/AIN3)PD4) RX.C
N$1238: IC2.11((XCK/AIN4/PCINT12)PD5) TX.C
N$1239: IC2.9((TXD1/INT3)PD3) R75.2
N$1240: IC2.8((RXD1/AIN1/INT2)PD2) R59.2
N$1243: IC2.30(D-) R79.1
OUT1A5: A1.P27(OUT1A) JP7.2
OUT1A6: A2.P27(OUT1A) JP6.2
OUT1A7: A3.P27(OUT1A) JP5.2
OUT1A8: A4.P27(OUT1A) JP4.2
OUT1A9: A5.P27(OUT1A) JP3.2
OUT1B5: A1.P24(OUT1B) JP7.1
OUT1B6: A2.P24(OUT1B) JP6.1
OUT1B7: A3.P24(OUT1B) JP5.1
OUT1B8: A4.P24(OUT1B) JP4.1
OUT1B9: A5.P24(OUT1B) JP3.1
OUT2A5: A1.P30(OUT2A) JP7.3
OUT2A6: A2.P30(OUT2A) JP6.3
OUT2A7: A3.P30(OUT2A) JP5.3
OUT2A8: A4.P30(OUT2A) JP4.3
OUT2A9: A5.P30(OUT2A) JP3.3
OUT2B5: A1.P01(OUT2B) JP7.4
OUT2B6: A2.P01(OUT2B) JP6.4
OUT2B7: A3.P01(OUT2B) JP5.4
OUT2B8: A4.P01(OUT2B) JP4.4
OUT2B9: A5.P01(OUT2B) JP3.4
P-STOP: C4.1 IC1.35(PL0(ICP4)) LED5.C P-STOP.1 R11.1
POTS-SCL: IC1.68(PJ5(PCINT14)) LC1.3(SCL) LC2.3(SCL) LC3.3(SCL) LC4.3(SCL) LC7.3(SCL)
RD+2: IC2.29(D+) R81.1
RESET: C1.2 C46.2 IC1.30(RESET) PIN1.5 R1.1 RESET.1(S) RESET.2(S1)
RIGHT: IC1.64(PJ1(TXD3/PCINT10)) SV2.19
RLED: IC1.58((A13)PC5) SV2.15
SCL: IC1.43((SCL/INT0)PD0) LC6.6(SCL) PIN5.1 R117.1
SD-CD: IC1.18(PH6(OC2B)) SV2.12
SD-CS: IC1.19((SS/PCINT0)PB0) SV2.9
SD-MOSI: IC1.21((MOSI/PCINT2)PB2) PIN1.4 SV2.7
SD-SCK: IC1.20((SCK/PCINT1)PB1) PIN1.3 SV2.10
SD-WP: IC1.17(PH5(OC4C)) SV2.11
SDA: IC1.44((SDA/INT1)PD1) LC6.7(SDA) PIN6.1 R114.1
SENSE11: A1.P25(SENSE1) R26.2
SENSE12: A1.P32(SENSE2) R27.2
SENSE13: A2.P25(SENSE1) R50.2
SENSE14: A2.P32(SENSE2) R51.2
SENSE15: A3.P25(SENSE1) R73.2
SENSE16: A3.P32(SENSE2) R74.2
SENSE17: A4.P25(SENSE1) R98.2
SENSE18: A4.P32(SENSE2) R99.2
SENSE19: A5.P25(SENSE1) R125.2
SENSE20: A5.P32(SENSE2) R126.2
THERMO-CS1: IC1.5((OC3A/AIN1)PE3) R129.1 R130.1
THERMO-CS2: IC1.6((OC3B/INT4)PE4) R131.1 R132.1
THERMO-DO: IC1.7((OC3C/INT5)PE5) R133.1 R134.1
THERMO-SCK: IC1.4((XCK0/AIN0)PE2) R135.1 R136.1
UART0-RX: IC1.2((RXD0/PCIN8)PE0) R75.1
UART0-TX: IC1.3((TXD0)PE1) R59.1
UART1-RX: IC1.45((RXD1/INT2)PD2) PIN3.1 SV2.1
UART1-TX: IC1.46((TXD1/INT3)PD3) PIN4.1 SV2.3
UP: IC1.67(PJ4(PCINT13)) SV2.24
USHIELD2: L1.2 R84.1 R85.1 X8.P$1 X8.P$2
UVCC: C45.2 IC2.31(UVCC) X8.1
VUCAP2: C47.2 IC2.27(UCAP)
X-DIR: A5.P20(DIR) IC1.97((ADC0)PF0)
X-EN: A5.P05(ENABLE) IC1.95((ADC2)PF2) R111.1
X-MAX: C14.1 IC1.36(PL1(ICP5)) LED7.C R30.1 X-MAX.1
X-POT: IC1.94((ADC3)PF3) R118.2
X-STEP: A5.P17(STEP) IC1.96((ADC1)PF1)
Y-DIR: A4.P20(DIR) IC1.93((ADC4/TCK)PF4)
Y-EN: A4.P05(ENABLE) IC1.91((ADC6/TDO)PF6) R91.1
Y-MAX: C20.1 IC1.38(PL3(OC5A)) LED10.C R42.1 Y-MAX.1
Y-MIN: IC1.37(PL2(T5)) M7.4(G) PIN7.1 PIN8.1 R83.2
Y-POT: IC1.90((ADC7/TDI)PF7) R93.2
Y-STEP: A4.P17(STEP) IC1.92((ADC5/TMS)PF5)
Z-DIR: A3.P20(DIR) IC1.89(PK0(ADC8/PCINT16))
Z-EN: A3.P05(ENABLE) IC1.87(PK2(ADC10/PCINT18)) R64.1
Z-MAX: C41.1 IC1.42(PL7) LED16.C R71.1 Z-MAX.1
Z-MIN: C32.1 IC1.41(PL6) LED12.C R55.1 Z-MIN.1
Z-POT: IC1.86(PK3(ADC11/PCINT19)) R66.2
Z-STEP: A3.P17(STEP) IC1.88(PK1(ADC9/PCINT17))
Unconnected: 15A_SWITCH.1B(OUT1) IC1.8((T3/INT6)PE6) IC1.9((CLKO/ICP3/INT7)PE7) IC1.27(PH7(T4)) IC1.28((TOSC2)PG3) IC1.47((ICP1)PD4) IC1.48((XCK1)PD5) IC1.49((T1)PD6) IC1.50((T0)PD7) IC1.51((WR)PG0) IC1.77((AD1)PA1) IC1.78((AD0)PA0) IC1.79(PJ7) IC1.83(PK6(ADC14/PCINT22)) IC1.84(PK5(ADC13/PCINT21)) IC1.85(PK4(ADC12/PCINT20)) IC2.5((AIN2/PCINT11)PC2) IC2.6((OC0B/INT0)PD0) IC2.7((AIN0/INT1)PD1) IC2.12((RTS/AIN5/INT6)PD6) IC2.14((SS/PCINT0)PB0) IC2.18((T1/PCINT4)PB4) IC2.19((PCINT5)PB5) IC2.20((PCINT6)PB6) IC2.21((PCINT7/OC0A/OC1C)PB7) IC2.22((INT4/ICP1/CLK0)PC7) IC2.23((OC1A/PCINT8)PC6) IC2.25((PCINT9/OC1B)PC5) IC2.26((PCINT10)PC4) LC6.5(LED3)

## Notes on the sheet
- CloneBoard-Revision1.2
- AGND > GND
- COM | NO | COM | NO | COM | NO
- COM | NO | COM | NO
- COMMON ANODE STRIP

## Library data of the parts
5V 24V ACT D-0 D-1-D-3 F1-F7 LED4 LED5 LED7 LED9 LED10 LED12 LED14 LED16 LED19 LED21 RX TX = SparkFun:LED: LEDs Standard schematic elements and footprints for 5mm, 3mm, 1206, and 0603 sized LEDs. 5mm - Spark Fun Electronics SKU : COM-00529 (and others)
15A_SWITCH = MakerBot:PWRSWITCH
-24V+ = con-phoenix-508:MSTBV2: PHOENIX; MPN: MSTBV 2,5/2-GF-5.08; OC_FARNELL: 1792792; OC_NEWARK: 69R9845
A1-A5 = A4982:A4982
C1-C8 C10 C11 C14 C17-C29 C32-C42 C45 C47-C54 C57-C63 C66-C73 = SparkFun:CAP: Capacitor Standard 0603 ceramic capacitor, and 0.1" leaded capacitor.
C9 = rcl:CPOL-EU: POLARIZED CAPACITOR, European symbol
C12 C13 = rcl:C-EU: CAPACITOR, European symbol
C15 C30 C43 C55 C64 = microbuilder:CAP_TANTALUM: Tantalum Capacitors Wave footprints have larger pads and are meant to be used for hand soldering. Reflow footprints are optimised for solder paste and a reflow oven. EIA3216-18/A-[R/W] - Size A / 3216-18 / 1206 footprint 4.7µF 25V 10% Tantalum Capacitor 10µF 16V 10% Tantalum Capacitor [Digikey: 495-2236-2-ND] EIA3528-21/B-[R/W] - Size B / 3528-21 47µF 10V 10% Tantalum Capactior [Digikey: 495-2216-1-ND] EIA6032-28/C-[R/W] - Size C / 6032-28 10µF 35V 20% Tantalum Capacitor [Digikey: 495-2285-1-ND] 100µF 16V 10% Tantalum Capactior [Digikey: 399-5214-1-ND]
C16 C31 C44 C46 C56 C65 = SparkFun-Capacitors:CAP: Capacitor Standard 0603 ceramic capacitor, and 0.1" leaded capacitor.
D1 = diode:SUPPRESSOR-: Suppressor diode
FAN-1 FAN-2 HBP L-COOL L-HEAT R-COOL R-HEAT = CLONE:MSTBV2: PHOENIX; MPN: MSTBV 2,5/2-GF-5.08; OC_FARNELL: 1792792; OC_NEWARK: 69R9845
FID1-FID4 = SmartPrj:FIDUCIALMOUNT
FUSE_HOLDER = SparkFun-Passives:FUSE
HBP-T = CB_R2:M03: Header 3 Standard 3-pin 0.1" header. Use with straight break away headers (SKU : PRT-00116), right angle break away headers (PRT-00553), swiss pins (PRT-00743), machine pins (PRT-00117), and female headers (PRT-00115). Molex polarized connector foot print use with SKU : PRT-08232 with associated crimp pins and housings.
IC1 = atmel2560:ATMEGA*: MICROCONTROLLER 64/128/256 Kbytes FLASH 4 Kbytes EEPROM 8 Kbytes SRAM 86 General Purpose I/O pins 12-channels16-bit PWM 4 x Serial USARTs 16-channels 10-bit A/D
IC2 = 1untitled:ATMEGA8U2
JP1 JP2 P-STOP X-MAX Y-MAX Z-MAX Z-MIN = SparkFun-Connectors:M02: Standard 2-pin 0.1" header. Use with - straight break away headers ( PRT-00116) - right angle break away headers (PRT-00553) - swiss pins (PRT-00743) - machine pins (PRT-00117) - female headers (PRT-00115) Molex polarized connector foot print use with: PRT-08233 with associated crimp pins and housings. 2.54_SCREWTERM for use with PRT-10571. 3.5mm Screw Terminal footprints for PRT-08084 5mm Screw Terminal footprints for use with PRT-08432
JP3-JP7 RGB+ = CB_R2:M04: Header 4 Standard 4-pin 0.1" header. Use with straight break away headers (SKU : PRT-00116), right angle break away headers (PRT-00553), swiss pins (PRT-00743), machine pins (PRT-00117), and female headers (PRT-00115). Molex polarized connector foot print use with SKU : PRT-08231 with associated crimp pins and housings. 1MM SMD Version SKU: PRT-10208
L1 = wuerth-elektronik:WE-CBF: SMD EMI Suppression Ferrite Beads - excellent anti-EMI properties - low DCR - impedances till 3000 ohms - rated current up to 6 A
LC1-LC4 LC7 = MakerBot:MCP4018
LC5 = MakerBot:74HC3G14DC
LC6 = MakerBot:PCA9533
M1-M7 = MakerBot:PSMN7R0-30YL
M8-M10 = MakerBot:FDV301N
P1 = logxen:R-78
PIN1 = pinhead:PINHD-2X3: PIN HEADER
PIN2 = SmartPrj:PINHD-2X3: PIN HEADER
PIN3-PIN8 = CB_R2:PINHD-1X1: PIN HEADER
PIN9-PIN12 = pinhead:PINHD-1X1: PIN HEADER
R1-R83 R86-R139 = SparkFun:RESISTOR: Resistor Basic schematic elements and footprints for 0603, 1206, and PTH 1/10th watt (small) resistors.
R84 R85 = varistor:VARISTOR: VARISTOR
RESET = switch-omron:10-XX: OMRON SWITCH
SPEAKER = buzzer:F/QMB: BUZZER Source: Buerklin; OC_FARNELL: unknown; OC_NEWARK: unknown
SV2 = con-harting-ml:ML26: HARTING; OC_FARNELL: unknown; OC_NEWARK: unknown
T1 T2 = reprap:MAX6675: Thermocouple amplifier and A to D converter
X8 = SmartPrj:PN61729: BERG USB connector
Y1 Y2 = crystal:CRYTAL: CRYSTAL

## Net classes
0 default: width 0.203 mm, drill 0.508 mm, clearance 0.203 mm
1 24V: width 0.889 mm, drill 0.635 mm, clearance 0.508 mm
2 gnd: width 0.381 mm, drill 0.508 mm, clearance 0.254 mm
3 5V: width 0.381 mm, drill 0.508 mm, clearance 0.254 mm
4 3.3V: width 0.381 mm, drill 0.508 mm, clearance 0.254 mm